# EAGLE design jn5189_pcb_v1 (EAGLE 9.6.2)
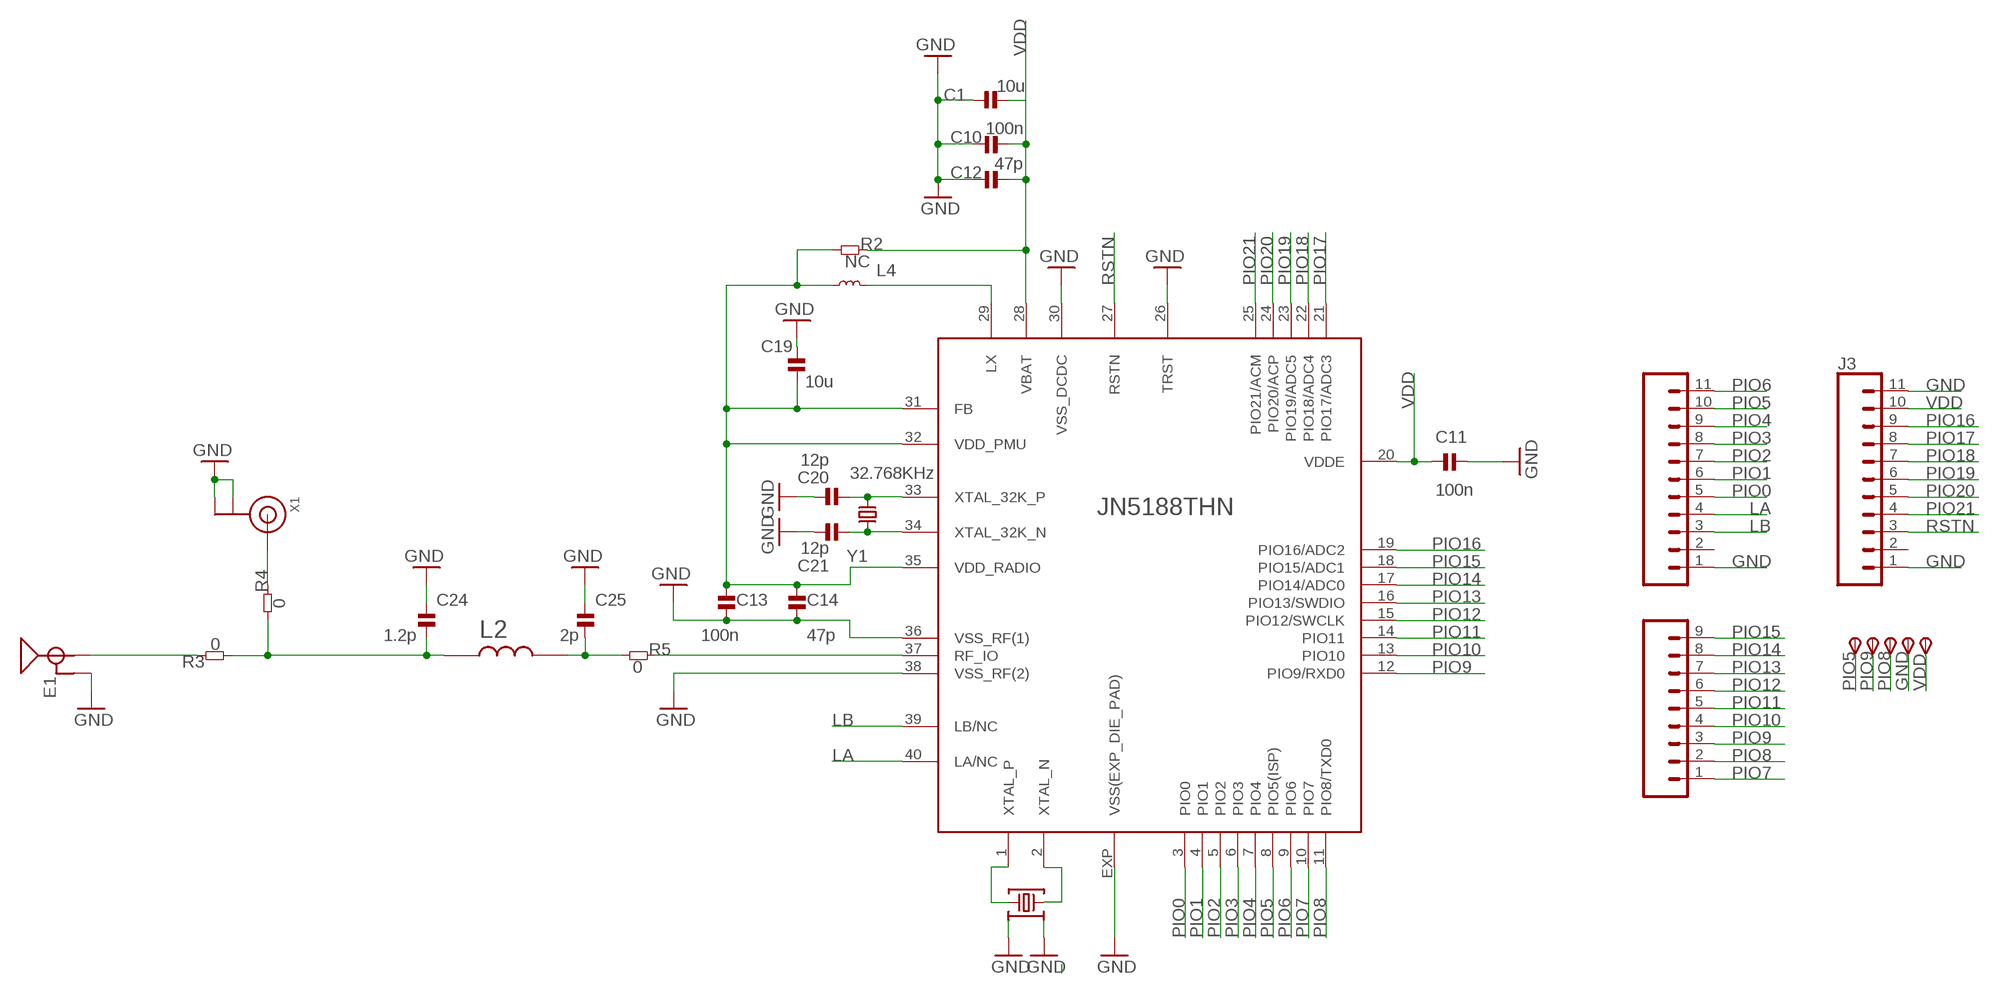
[diagram p0: schematic, sheet 1]

## Parts
3V3  TPSTP11R  [TP11R]
C1  10u  CAP-0805  [_PKG_C_0805]
C10  100n  CAP-0402  [_PKG_C_0402]
C11  100n  CAP-0402  [_PKG_C_0402]
C12  47p  CAP-0402  [_PKG_C_0402]
C13  100n  CAP-0402  [_PKG_C_0402]
C14  47p  CAP-0402  [_PKG_C_0402]
C19  10u  CAP-0805  [_PKG_C_0805]
C20  12p  CAP-0402  [_PKG_C_0402]
C21  12p  CAP-0402  [_PKG_C_0402]
C24  1.2p  CAP-0402  [_PKG_C_0402]
C25  2p  CAP-0402  [_PKG_C_0402]
E1  ANTENNA-GROUNDEDTRACE-15.2MM  [TRACE_ANTENNA_2.4GHZ_15.2MM]
GND  TPSTP11R  [TP11R]
ISP  TPSTP11R  [TP11R]
J1  CONN_11_1.27MM  [1X11-1.27MM]
J2  CONN_051.27MM  [1X05_1.27MM]
J3  CONN_11_1.27MM  [1X11-1.27MM]
L2  3.3n  IND0402IND0402  [INDC1005X40N]
L4  4.7uH  INDUCTOR-0805  [_PKG_C_0805]
R2  NC  RES-0402  [_PKG_C_0402]
R3  0  RES-0402  [_PKG_C_0402]
R4  0  RES-0402  [_PKG_C_0402]
R5  0  RES-0402  [_PKG_C_0402]
RXD  TPSTP11R  [TP11R]
TXD  TPSTP11R  [TP11R]
U$1  JN5188THN  [JN5188THN]
X1  ANTENNA_U.FL  [U.FL]
Y1  32.768KHz  32.768KHZ_Q13FC1350000400  [XTAL-2P-3215]
Y2  32Mhz  48.000MHZ_CX2016DB48000C0FPLC1  [XTAL-4P-2016]

## Nets
GND: C1.1 C10.2 C11.1 C12.2 C13.1 C14.1 C19.1 C20.1 C21.1 C24.2 C25.2 E1.GND GND.TP(PP) J1.1 J3.1 J3.11 U$1.26(TRST) U$1.30(VSS_DCDC) U$1.36(VSS_RF(1)) U$1.38(VSS_RF(2)) U$1.EXP(VSS(EXP_DIE_PAD)) X1.1(GND) X1.2(GND) Y2.2 Y2.4
LA: J1.4 U$1.40(LA/NC)
LB: J1.3 U$1.39(LB/NC)
N$1: L4.2 U$1.29(LX)
N$5: U$1.1(XTAL_P) Y2.1
N$7: U$1.2(XTAL_N) Y2.3
N$9: C13.2 C14.2 C19.2 L4.1 R2.2 U$1.31(FB) U$1.32(VDD_PMU) U$1.35(VDD_RADIO)
N$10: R5.1 U$1.37(RF_IO)
N$11: C25.1 L2.2 R5.2
N$12: C24.1 L2.1 R3.2 R4.2
N$13: R4.1 X1.3(SIGNAL)
N$14: E1.ANT(SIGNAL) R3.1
PIO0: J1.5 U$1.3(PIO0)
PIO1: J1.6 U$1.4(PIO1)
PIO2: J1.7 U$1.5(PIO2)
PIO3: J1.8 U$1.6(PIO3)
PIO4: J1.9 U$1.7(PIO4)
PIO5: ISP.TP(PP) J1.10 U$1.8(PIO5(ISP))
PIO6: J1.11 U$1.9(PIO6)
PIO7: J2.1 U$1.10(PIO7)
PIO8: J2.2 TXD.TP(PP) U$1.11(PIO8/TXD0)
PIO9: J2.3 RXD.TP(PP) U$1.12(PIO9/RXD0)
PIO10: J2.4 U$1.13(PIO10)
PIO11: J2.5 U$1.14(PIO11)
PIO12: J2.6 U$1.15(PIO12/SWCLK)
PIO13: J2.7 U$1.16(PIO13/SWDIO)
PIO14: J2.8 U$1.17(PIO14/ADC0)
PIO15: J2.9 U$1.18(PIO15/ADC1)
PIO16: J3.9 U$1.19(PIO16/ADC2)
PIO17: J3.8 U$1.21(PIO17/ADC3)
PIO18: J3.7 U$1.22(PIO18/ADC4)
PIO19: J3.6 U$1.23(PIO19/ADC5)
PIO20: J3.5 U$1.24(PIO20/ACP)
PIO21: J3.4 U$1.25(PIO21/ACM)
RSTN: J3.3 U$1.27(RSTN)
VDD: 3V3.TP(PP) C1.2 C10.1 C11.2 C12.1 J3.10 R2.1 U$1.20(VDDE) U$1.28(VBAT)
X32K_Q1: C20.2 U$1.33(XTAL_32K_P) Y1.1
X32K_Q2: C21.2 U$1.34(XTAL_32K_N) Y1.2
Unconnected: J1.2 J3.2

## Library data of the parts
3V3 GND ISP RXD TXD = testpad:TPS: TEST PIN
C1 C10-C14 C19-C21 C24 C25 = ok-discretes-dev:CAP
E1 = SparkFun-RF:ANTENNA-GROUNDED: Antenna w/ Ground Connection 2.4GHz antennae with signal and ground terminals. TRACE_ANTENNA_2.4GHZ_15.2MM - Meander Trace antenna 15.2 x 5.7mm footprint Based on layout from TI app note AN043 <http://www.ti.com/lit/an/swra117d/swra117d.pdf>. TRACE_ANTENNA_2.4GHZ_25.7MM - Inverted F trace antenna 25.7 x 7.5 mm footprint. Based on layout from TI design note DN0007 <http://www.ti.com/lit/an/swru120b/swru120b.pdf>.
J1 J3 = SparkFun-Connectors:CONN_11: Multi connection point. Often used as Generic Header-pin footprint for 0.1 inch spaced/style header connections On any of the 0.1 inch spaced packages, you can populate with these: Break Away Headers - Straight <https://www.sparkfun.com/products/116> (PRT-00116) Break Away Male Headers - Right Angle <https://www.sparkfun.com/products/553> (PRT-00553) Female Headers <https://www.sparkfun.com/products/115> (PRT-00115) Break Away Headers - Machine Pin <https://www.sparkfun.com/products/117> (PRT-00117) Break Away Female Headers - Swiss Machine Pin <https://www.sparkfun.com/products/743> (PRT-00743) For SCREWTERMINALS and SPRING TERMINALS visit here: Screw Terimnals on SparkFun.com <https://www.sparkfun.com/search/results?term=Screw+Terminals> (5mm/3.5mm/2.54mm spacing) This device is also useful as a general connection point to wire up your design to another part of your project. Our various solder wires solder well into these plated through hole pads. Hook-Up Wire - Assortment (Stranded, 22 AWG) <https://www.sparkfun.com/products/11375> (PRT-11375) Hook-Up Wire - Assortment (Solid Core, 22 AWG) <https://www.sparkfun.com/products/11367> (PRT-11367) View the entire wire category on our website here <https://www.sparkfun.com/categories/141>
J2 = SparkFun-Connectors:CONN_05: Multi connection point. Often used as Generic Header-pin footprint for 0.1 inch spaced/style header connections On any of the 0.1 inch spaced packages, you can populate with these: Break Away Headers - Straight <https://www.sparkfun.com/products/116> (PRT-00116) Break Away Male Headers - Right Angle <https://www.sparkfun.com/products/553> (PRT-00553) Female Headers <https://www.sparkfun.com/products/115> (PRT-00115) Break Away Headers - Machine Pin <https://www.sparkfun.com/products/117> (PRT-00117) Break Away Female Headers - Swiss Machine Pin <https://www.sparkfun.com/products/743> (PRT-00743) For SCREWTERMINALS and SPRING TERMINALS visit here: Screw Terimnals on SparkFun.com <https://www.sparkfun.com/search/results?term=Screw+Terminals> (5mm/3.5mm/2.54mm spacing) This device is also useful as a general connection point to wire up your design to another part of your project. Our various solder wires solder well into these plated through hole pads. Hook-Up Wire - Assortment (Stranded, 22 AWG) <https://www.sparkfun.com/products/11375> (PRT-11375) Hook-Up Wire - Assortment (Solid Core, 22 AWG) <https://www.sparkfun.com/products/11367> (PRT-11367) View the entire wire category on our website here <https://www.sparkfun.com/categories/141> Special notes: Molex polarized connector foot print use with SKU : PRT-08231 with associated crimp pins and housings. 1MM SMD Version SKU: PRT-10208
L2 = discretes-dev:IND0402: RESISTOR, 0402 0.063W 1% 3M6; Resistance:3.6Mohm; Resistance Tolerance:± 1%; Power Rating:0.063W; Voltage Rating:50V; Series:RC32H; Temperature Coefficient:± 100ppm/°C; Resistor Element Type:Thick Film; Resistor Case Style:0402; No. of Pins:2; SVHC:No SVHC; Case Style:0402; External Length / Height:1mm; Temperature Coeff. +:100ppm/°C; Temperature Coeff. -:100ppm/°C; External Depth:0.35mm; External Width:0.5mm; Operating Temperature Range:-55°C to +155°C; Overload Voltage:100V Check prices <https://pricing.snapeda.com/parts/RC0402FR-073M6L/Yageo/view-part?ref=eda>; AVAILABILITY: Good; DESCRIPTION: RESISTOR, 0402 0.063W 1% 3M6; Resistance:3.6Mohm; Resistance Tolerance:± 1%; Power Rating:0.063W; Voltage Rating:50V; Series:RC32H; Temperature Coefficient:± 100ppm/°C; Resistor Element Type:Thick Film; Resistor Case Style:0402; No. of Pins:2; SVHC:No SVHC; Case Style:0402; External Length / Height:1mm; Temperature Coeff. +:100ppm/°C; Temperature Coeff. -:100ppm/°C; External Depth:0.35mm; External Width:0.5mm; Operating Temperature Range:-55°C to +155°C; Overload Voltage:100V; MF: Yageo; MP: RC0402FR-073M6L; PACKAGE: 1005 Panasonic Electronic Components; PRICE: None; PURCHASE-URL: https://pricing.snapeda.com/search/part/RC0402FR-073M6L/?ref=eda
L4 = ok-discretes-dev:INDUCTOR
R2-R5 = ok-discretes-dev:RES
U$1 = JN5189_ HVQFN40:JN5188THN: JN5168 - ZigBee, RF4CE, JenNet-IP and IEEE802.15.4 wireless microcontroller with 256 kB Flash, 32 kB RAM Check availability <https://pricing.snapeda.com/parts/JN5168/A02Z/NXP%20Semiconductors/view-part?ref=eda>; AVAILABILITY: Not in stock; DESCRIPTION: JN5168 - ZigBee, RF4CE, JenNet-IP and IEEE802.15.4 wireless microcontroller with 256 kB Flash, 32 kB RAM; MF: NXP Semiconductors; MP: JN5168/A02Z; PACKAGE: None; PRICE: None
X1 = adafruit:ANTENNA_U.FL: U.FL Antenna Connector
Y1 = ok-xtal-osc-dev:32.768KHZ_Q13FC1350000400: SMD Crystal Resonators 32.768KHz +/-20ppm SMD-3215_2P RoHS Datasheet <https://datasheet.lcsc.com/szlcsc/1901081604_Seiko-Epson-Q13FC1350000400_C32346.pdf>; LCSC_PART: C32346; MFG_NAME: SEIKO EPSON; MFG_PART: Q13FC1350000400
Y2 = ok-xtal-osc-dev:48.000MHZ_CX2016DB48000C0FPLC1: 48MHz ±10ppm Crystal 7pF 50 Ohms 4-SMD, No Lead Datasheet <https://media.digikey.com/pdf/Data%20Sheets/Kyocera%20International/CX2016DB48000C0FPLC1_DS.pdf>; DIGIKEY_PART: 1253-2042-1-ND; MFG_NAME: KYOCERA; MFG_PART: CX2016DB48000C0FPLC1

## Board
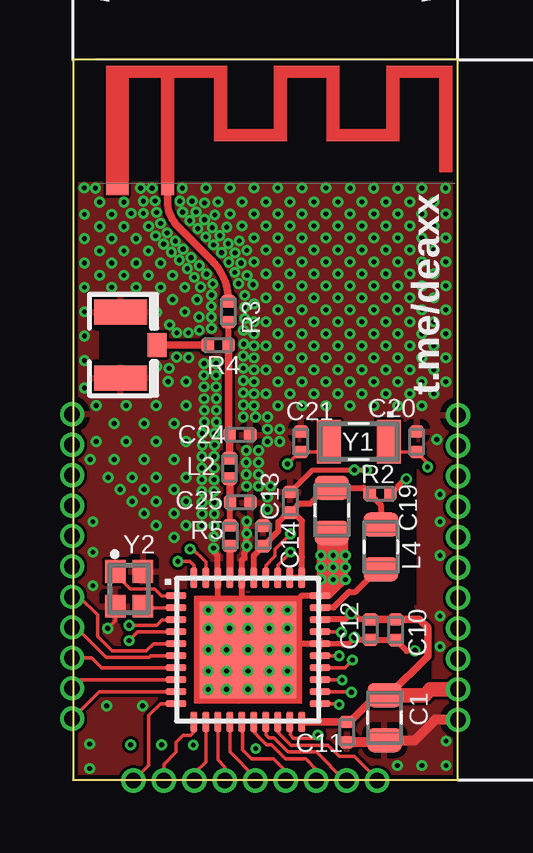
[diagram p1: board, top side]
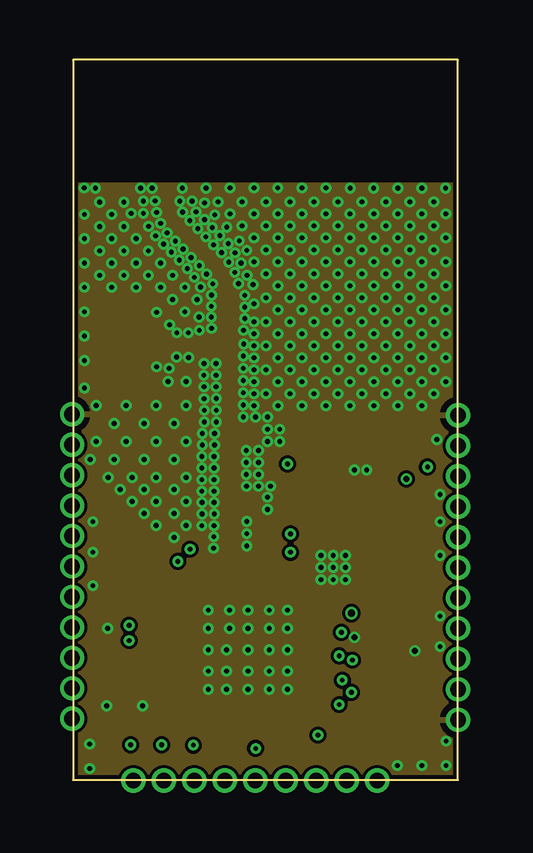
[diagram p2: board, inner layer Route2]
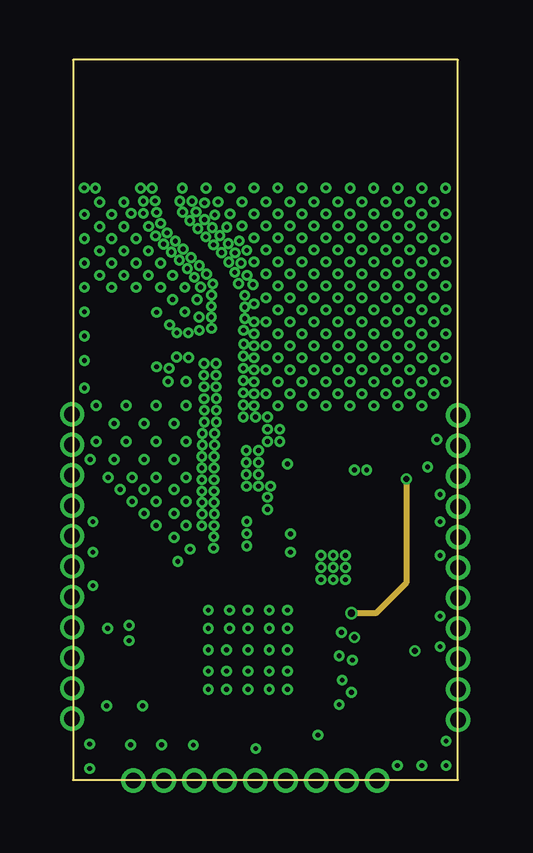
[diagram p3: board, inner layer Route15]
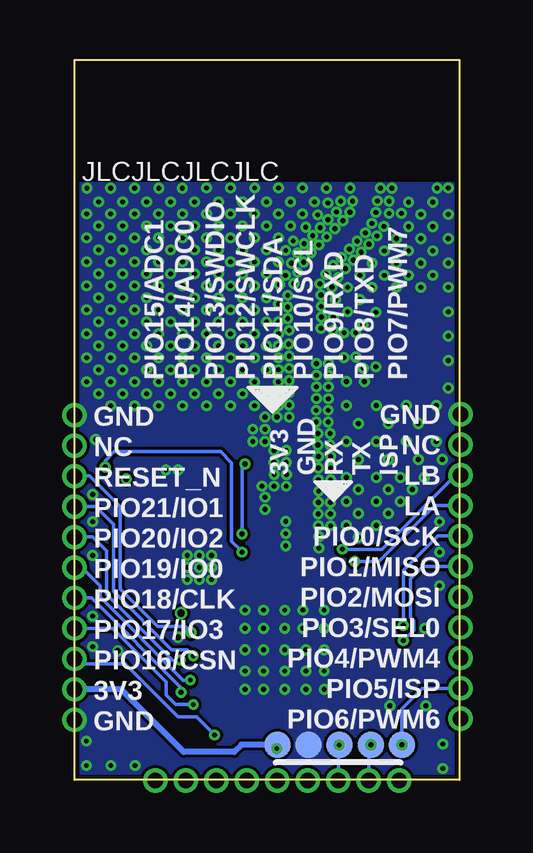
[diagram p4: board, bottom side, seen from below]

Size 16.05 x 30.01 mm. Coordinates in mm from the lower left corner, seen from the top.
Outline: 16.05,0 16.05,30.01 0,30.01 0,0 16.05,0
Copper layers (1*2*15*16): Top 0.035559375mm / dielectric 0.17018125mm / Route2 0.01778125mm / dielectric 0.4mm / Route15 0.01778125mm / dielectric 0.17018125mm / Bottom 0.035559375mm
Design rules "oshpark-4layer *": minimum track width 6mil, minimum drill 0.2mm, track to track 5mil, track to pad 5mil, pad to pad 5mil, via to via 5mil, smd to smd 5mil, copper to edge 0.16mm, drill to drill 0.2mm, minimum pad ring 4mil, minimum via ring 4mil, stop-mask expansion 2.5mil, vias tented up to drill 50mil, thermal gap 10mil
tRestrict: area 11.4,3.9 to 14.9,7.2

### Footprints (pad centres in the part's own frame; a part is rotated, then mirrored left to right if it is on the bottom)
TP11R = smd 1.1 x 1.1: TP 0,0
_PKG_C_0805 = smd 1 x 1.42: 1 -0.935,0; 2 0.935,0
_PKG_C_0402 = smd 0.54 x 0.6: 1 -0.43,0; 2 0.43,0
TRACE_ANTENNA_2.4GHZ_15.2MM = smd 0.5 x 0.5: ANT 0,-0.25 | smd 0.9 x 0.5: GND -2.1,-0.25
1X11-1.27MM = drill 0.65 pad 1.016: 1 0,0; 2 1.27,0; 3 2.54,0; 4 3.81,0; 5 5.08,0; 6 6.35,0; 7 7.62,0; 8 8.89,0; 9 10.16,0; 10 11.43,0; 11 12.7,0
1X05_1.27MM = drill 0.65 pad 1.016: 1 0,0; 2 1.27,0; 3 2.54,0; 4 3.81,0; 5 5.08,0; 6 6.35,0; 7 7.62,0; 8 8.89,0; 9 10.16,0
INDC1005X40N = smd 0.54 x 0.6: 1 -0.432,0; 2 0.432,0
JN5188THN = smd 0.85 x 0.3: 1 -3,2.25; 2 -3,1.75; 3 -3,1.25; 4 -3,0.75; 5 -3,0.25; 6 -3,-0.25; 7 -3,-0.75; 8 -3,-1.25; 9 -3,-1.75; 10 -3,-2.25; 21 3,-2.25; 22 3,-1.75; 23 3,-1.25; 24 3,-0.75; 25 3,-0.25; 26 3,0.25; 27 3,0.75; 28 3,1.25; 29 3,1.75; 30 3,2.25 | smd 0.3 x 0.85: 11 -2.25,-3; 12 -1.75,-3; 13 -1.25,-3; 14 -0.75,-3; 15 -0.25,-3; 16 0.25,-3; 17 0.75,-3; 18 1.25,-3; 19 1.75,-3; 20 2.25,-3; 31 2.25,3; 32 1.75,3; 33 1.25,3; 34 0.75,3; 35 0.25,3; 36 -0.25,3; 37 -0.75,3; 38 -1.25,3; 39 -1.75,3; 40 -2.25,3 | smd 4 x 4: EXP 0.001,-0.013
U.FL = smd 2.2 x 1.05: 1 0,1.375; 2 0,-1.375 | smd 0.8 x 1: 3 1.525,0
XTAL-2P-3215 = smd 1 x 1.8: 1 -1.25,0; 2 1.25,0
XTAL-4P-2016 = smd 0.95 x 0.85: 1 -0.725,-0.575; 2 0.725,-0.575; 3 0.725,0.575; 4 -0.725,0.575

### Placement (x,y rotation side)
3V3  7.6,1.46 0 bottom
C1  12.99,2.59 90 top
C10  13.46,6.26 270 top
C11  11.41,1.99 90 top
C12  12.4,6.26 270 top
C13  9.06,11.57 270 top
C14  7.93,10.17 270 top
C19  10.79,11.24 90 top
C20  14.33,14.1 270 top
C21  9.5,14.1 270 top
C24  6.96,14.38 0 top
C25  6.97,11.57 0 top
E1  3.94,24.87 0 top
GND  6.3,1.46 0 bottom
ISP  2.4,1.46 0 bottom
J1  -0.04,15.25 270 top
J2  2.52,-0.03 0 top
J3  16.05,15.2 270 top
L2  6.53,12.98 270 top
L4  12.84,9.71 270 top
R2  12.8,11.93 180 top
R3  6.48,19.51 270 top
R4  6.05,18.12 0 top
R5  6.55,10.18 90 top
RXD  5,1.46 0 bottom
TXD  3.7,1.46 0 bottom
U$1  7.29,5.42 0 top
X1  1.99,18.13 0 top
Y1  11.91,14.1 180 top
Y2  2.34,7.96 270 top

### Tracks (layer width: path | path; a pad name or v marks a point on that pad's centre or on a via)
GND  (via drill 0.2 pad 0.45, 0.25)
  Top 0.152: Y2.2 1.76,6.63 v1.45,6.31 | C12.2 12.38,5.8
  Top 0.2: C13.1 9.98,12.92 v11.73,12.92 v12.24,12.92 | v11.73,5.93 11.48,5.67 U$1.26
  Top 0.254: v6.53,7.07 6.04,7.56 U$1.38 6.02,8.44 6.02,9.36 5.86,9.52 v5.86,9.66 | v7.29,7.07 7.04,7.32 U$1.36 7.04,9.15 7.16,9.27 7.16,9.51 7.24,9.59 v7.24,9.76 v7.24,10.26 v7.24,10.77 | U$1.30 9.55,7.68 v8.94,7.07 | U$1.30 10.29,8.6 | 10.29,8.6 10.29,8.98 | 10.29,8.98 10.29,9.23 | 10.29,9.23 10.29,9.49 | 10.29,9.49 10.29,10.06 10.34,10.11 10.34,9.79 | v11.35,8.34 11.35,8.47 | 11.35,8.47 v11.35,8.85 | v11.35,8.85 11.35,9.11 | 11.35,9.11 v11.35,9.36 | v11.35,9.36 11.35,9.61 | 11.35,9.61 11.35,9.74 | 11.35,9.74 11.35,10.5 11,10.5 C19.1 | v10.34,8.34 10.97,8.34 | 10.97,8.34 v11.35,8.34 | 10.46,7.71 10.33,7.71 U$1.30 | v10.34,8.34 10.46,8.47 11.35,8.47 | v11.35,8.85 11.1,8.6 10.29,8.6 | v11.35,8.85 v10.34,8.85 10.59,9.11 11.35,9.11 | v11.35,8.85 10.42,8.85 10.29,8.98 | v11.35,9.36 11.23,9.23 10.29,9.23 | v10.34,9.36 v11.35,9.36 | v11.35,9.36 10.42,9.36 10.29,9.49 | v10.34,9.36 10.59,9.61 11.1,9.61 | 11.23,9.61 11.35,9.61 | 11.35,9.74 11.29,9.68 | 11.29,9.68 11.23,9.61 | 11.23,9.61 11.1,9.61 | C19.1 10.79,10.24 10.44,9.89 | C19.1 10.79,9.92 | 10.79,9.92 10.85,9.87 | 10.85,9.87 11.1,9.61 | v10.34,9.36 10.34,9.79 | 10.34,9.79 10.44,9.89 | 10.44,9.89 10.44,9.76 v10.85,9.36 | v10.85,9.36 10.85,9.87 | v10.85,9.36 10.79,9.41 10.79,9.82 | C19.1 10.79,10.17 11.29,9.68 | v11.35,9.36 v10.85,9.36 | v10.34,9.36 10.79,9.82 | 10.79,9.82 10.79,9.92 | v10.34,8.34 10.34,7.84 10.46,7.71 | v10.85,8.34 10.85,7.84 | 10.85,7.84 10.66,7.65 10.59,7.65 10.59,7.71 | v10.34,8.34 10.59,8.09 10.59,7.71 | 10.46,7.71 10.97,8.22 10.97,8.34 | U$1.30 10.96,8.34 v11.35,8.34 | v11.35,8.34 10.85,7.84 | 10.46,7.71 10.59,7.71 | U$1.26 8.84,5.67 8.57,5.94 8.18,5.55 v8.18,5.42 | v14.25,5.37 13.91,5.37 C10.2 C12.2 11.84,5.83 v11.73,5.93
  Top 0.406: J3.11 15.11,2.5 14.26,1.65 C1.1 12.9,1.56 C11.1
  other vias: 5.64,7.07 6.53,6.31 5.64,6.31 5.64,5.42 5.64,4.53 8.18,7.07 6.4,5.42 7.29,6.31 8.18,6.31 8.94,6.31 7.29,5.42 7.29,4.53 7.29,3.77 8.18,3.77 8.94,3.77 8.94,4.53 8.94,5.42 6.4,4.53 6.4,3.77 5.64,3.77 8.18,4.53 10.85,8.85 8.11,11.27 8.11,11.78 8.24,12.24 7.23,12.24 7.22,12.73 7.22,13.23 7.22,13.72 7.73,13.72 7.73,13.23 7.73,12.73 7.74,12.24 8.11,14.11 8.11,14.61 8.11,15.12 7.61,15.12 7.1,15.12 7.1,15.63 7.1,16.14 7.1,16.65 7.1,17.15 7.1,17.66 7.12,18.17 7.1,18.74 7.16,19.23 7.16,19.71 7.16,20.2 6.9,20.69 6.75,21.16 6.5,21.59 6.2,21.97 5.86,22.31 5.53,22.63 5.2,22.98 4.87,23.31 4.57,23.67 4.45,24.12 4.56,24.67 3.3,24.67 3.42,24.13 3.49,23.65 3.65,23.2 3.93,22.8 4.27,22.46 4.59,22.13 4.92,21.77 5.27,21.44 5.57,21.08 5.82,20.68 5.77,20.21 5.77,19.74 5.76,19.29 5.77,18.82 4.03,18.97 4.33,18.64 4.81,18.63 5.27,18.74 5.55,24.67 6.55,24.68 7.55,24.68 8.54,24.68 9.55,24.68 10.55,24.68 11.56,24.67 12.54,24.67 13.55,24.67 14.55,24.67 15.54,24.67 4.96,24.12 5.13,23.68 5.49,23.35 5.81,23.02 6.12,22.69 6.47,22.36 6.76,21.97 7,21.54 7.26,21.03 7.51,20.65 2.93,24.12 2.93,23.61 3.15,23.07 3.45,22.68 3.78,22.34 4.1,22 4.43,21.67 4.76,21.32 5.06,20.95 5.32,20.55 6.05,24.09 7.05,24.09 8.05,24.09 9.05,24.09 10.05,24.09 11.05,24.09 12.05,24.09 13.05,24.09 14.05,24.09 15.05,24.09 6.55,23.59 7.55,23.59 8.55,23.59 9.55,23.59 10.55,23.59 11.55,23.59 12.55,23.59 13.55,23.59 14.55,23.59 15.55,23.59 7.05,23.09 8.05,23.09 9.05,23.09 10.05,23.09 11.05,23.09 12.05,23.09 13.05,23.09 7.55,22.59 8.55,22.59 9.55,22.59 10.55,22.59 11.55,22.59 12.55,22.59 8.05,22.09 9.05,22.09 10.05,22.09 11.05,22.09 12.05,22.09 13.05,22.09 13.55,22.59 14.05,23.09 15.05,23.09 8.55,21.59 7.55,21.59 9.55,21.59 8.05,21.09 9.05,21.09 10.05,21.09 11.05,21.09 12.05,21.09 10.55,21.59 11.55,21.59 12.55,21.59 13.05,21.09 14.55,22.59 15.55,22.59 14.05,22.09 15.05,22.09 13.55,21.59 14.55,21.59 15.55,21.59 14.05,21.09 15.05,21.09 8.55,20.59 9.55,20.59 10.55,20.59 11.55,20.59 12.55,20.59 13.55,20.59 14.55,20.59 15.55,20.59 8.05,20.09 9.05,20.09 10.05,20.09 11.05,20.09 12.05,20.09 13.05,20.09 14.05,20.09 15.05,20.09 8.55,19.59 8.05,19.09 9.05,19.09 9.55,19.59 10.05,19.09 10.55,19.59 8.05,18.09 8.55,18.59 9.05,18.09 9.55,18.59 11.55,19.59 12.55,19.59 13.55,19.59 14.55,19.59 15.55,19.59 11.05,19.09 12.05,19.09 13.05,19.09 14.05,19.09 15.05,19.09 10.55,18.59 11.55,18.59 12.55,18.59 13.55,18.59 14.55,18.59 15.55,18.59 10.05,18.09 11.05,18.09 12.05,18.09 13.05,18.09 14.05,18.09 15.05,18.09 8.55,17.59 9.55,17.59 10.55,17.59 11.55,17.59 12.55,17.59 13.55,17.59 14.55,17.59 15.55,17.59 8.05,17.09 9.05,17.09 10.05,17.09 11.05,17.09 12.05,17.09 13.05,17.09 14.05,17.09 15.05,17.09 8.55,16.59 9.55,16.59 10.55,16.59 11.55,16.59 12.55,16.59 13.55,16.59 14.55,16.59 15.55,16.59 9.05,16.09 10.05,16.09 11.05,16.09 12.05,16.09 13.05,16.09 14.05,16.09 15.05,16.09 9.55,15.59 10.55,15.59 11.55,15.59 12.55,15.59 13.55,15.59 14.55,15.59 8.05,16.09 8.55,15.59 7.55,18.59 7.55,18.09 7.55,17.59 7.55,17.09 7.55,16.59 7.55,16.09 7.55,15.59 7.55,19.09 7.55,19.84 0.46,24.68 0.47,23.58 0.47,22.56 0.47,21.54 0.47,20.53 0.47,19.51 0.47,18.5 0.47,17.48 0.47,16.34 1.1,24.08 1.1,23.07 1.1,22.05 1.1,21.04 1.61,23.58 1.61,22.56 1.61,21.54 1.61,20.53 2.12,24.08 2.12,23.07 2.12,22.05 2.12,21.04 2.63,22.56 2.63,21.54 2.63,20.53 3.14,21.04 3.14,22.05 3.64,21.54 3.64,20.53 4.15,21.04 4.66,20.53 3.49,19.49 4.66,19.51 4.15,20.02 5.17,20.02 5.25,19.29 5.91,23.56 6.41,23.05 5.48,24.05 6.94,22.47 7.25,22.07 2.42,23.61 5.88,10.59 5.89,11.08 5.88,11.57 5.87,12.03 5.88,12.51 5.88,13 5.88,13.48 5.9,13.96 5.9,14.44 5.97,14.92 5.97,15.41 5.97,15.89 5.97,16.39 5.96,16.87 5.97,17.36 5.87,10.13 8.62,14.61 8.62,14.11 5.46,17.36 5.45,16.87 5.46,16.39 5.47,15.89 5.48,15.41 5.47,14.92 5.39,14.44 5.39,13.96 5.37,13.48 5.37,13 5.37,12.51 5.37,12.03 5.38,11.57 5.38,11.08 5.37,10.59 0.96,15.61 2.21,15.61 3.46,15.61 4.71,15.61 1.71,14.86 2.96,14.86 4.21,14.86 0.96,14.11 2.21,14.11 3.46,14.11 4.71,14.11 1.71,13.36 2.96,13.36 4.21,13.36 4.71,12.61 2.46,12.61 3.46,12.61 4.21,12.11 2.96,12.11 1.46,12.61 0.71,13.36 1.96,12.11 2.46,11.61 3.46,11.61 4.71,11.61 2.96,11.11 4.21,11.11 4.71,10.61 3.46,10.61 4.21,10.11 4.71,16.61 3.96,16.61 3.49,17.22 4.01,17.15 4.31,17.62 4.82,17.61 15.18,14.19 15.3,11.9 15.3,10.76 15.3,9.36 15.3,6.82 15.3,5.55 15.56,1.61 15.56,0.6 14.54,0.6 13.53,0.6 0.7,0.47 0.7,1.49 0.83,8.09 0.83,9.49 0.83,10.76 2.9,3.09 1.4,3.09 0.93,24.67 2.82,24.67
  pour Route2: -0.03,24.84 -0.03,-0.19 16.13,-0.19 16.13,24.84
  pour Bottom (no thermals): -0.03,-0.19 16.25,-0.19 16.25,24.86 -0.03,24.86
  pour Top: 14.4,14.69 14.4,7.2 9.45,7.2 9.45,14.82 16.28,14.82 16.28,24.85 -0.08,24.85 -0.08,-0.17 16.43,-0.17 16.43,14.69
LA  (via drill 0.2 pad 0.45)
  Top 0.152: U$1.40 5.04,8.94 4.88,9.11 v4.37,9.11
  Bottom 0.152: v4.37,9.11 3.35,9.11 1.02,11.43 0.3,11.43 J1.4
LB  (via drill 0.2 pad 0.45)
  Top 0.152: U$1.39 5.54,9.08 4.94,9.68 v4.88,9.61
  Bottom 0.152: v4.88,9.61 3.24,9.61 0.15,12.7 J1.3
N$1
  Top 0.254: U$1.29 10.3,7.17 10.31,7.19 10.86,7.19 11.51,7.84 11.77,7.84 12.71,8.78 L4.2
N$5
  Top 0.152: Y2.1 1.76,8.58 2.37,7.97 3.41,7.97 3.7,7.67 U$1.1
N$7
  Top 0.152: U$1.2 2.98,7.17 Y2.3
N$9
  Top 0.254: U$1.32 U$1.31 9.54,9.28 9.55,9.29 9.55,10.79 9.13,11.2 | U$1.35 7.54,9.35 C14.2 8.56,10.37 8.56,10.75 8.95,11.14 C13.2 9.13,11.2 | 9.13,11.2 9.44,11.52 9.89,11.52 10.54,12.17 C19.2 12.13,12.17 R2.2 12.84,11.46 L4.1 12.77,10.71 12.77,10.77
N$10
  Top 0.254: 6.54,9.74 R5.1
  Top 0.305: U$1.37 6.54,9.74
N$11
  Top 0.254: L2.2 arc45 L2.2 | C25.1 R5.2
  Top 0.305: C25.1 L2.2
N$12
  Top 0.254: R4.2 R3.2 | 6.52,14.36 arc-45 C24.1 | 6.5,14.45 arc45 C24.1 | C24.1 6.48,14.43 | L2.1 6.52,13.43
  Top 0.305: 6.48,14.43 R4.2 | 6.52,13.43 6.52,14.36
N$13
  Top 0.254: R4.1 | X1.3
  Top 0.305: X1.3 R4.1
N$14
  Top 0.254: R3.1 6.48,19.96
  Top 0.305: 6.48,19.96 arc45 5.77,21.68 4.37,23.08 arc-45 3.94,24.11 E1.ANT
PIO0  (via drill 0.2 pad 0.45)
  Top 0.152: U$1.3 3.71,6.67 3.48,6.44 v2.34,6.44
  Bottom 0.152: v2.34,6.44 2.34,8.72 0.9,10.16 0.43,10.16 0.27,10.16 J1.5
PIO1  (via drill 0.2 pad 0.45)
  Top 0.152: U$1.4 4.28,6.16 2.69,6.16 v2.34,5.8
  Bottom 0.152: v2.34,5.8 1.91,6.23 1.91,6.62 2.06,6.76 2.06,8.37 1.53,8.89 0.27,8.89 | 0.27,8.89 0.27,8.85 | J1.6 0.27,8.89
PIO2
  Top 0.152: U$1.5 3.35,5.67 3.05,5.38 1.62,5.38 1.02,5.98 1.02,6.87 0.26,7.62 J1.7
PIO3
  Top 0.152: U$1.6 3.24,5.17 3.17,5.1 1.38,5.1 0.12,6.35 J1.8
PIO4
  Top 0.152: U$1.7 1.18,4.67 0.77,5.08 0.43,5.08 0.27,5.08 J1.9
PIO5  (via drill 0.2 pad 0.45)
  Top 0.152: U$1.8 0.32,4.17 J1.10
  Bottom 0.152: ISP.TP 2.4,2.96 1.54,3.81 0.4,3.81 0.27,3.81 J1.10
  other vias: 2.4,1.46
PIO6
  Top 0.152: J1.11 1.09,3.67 U$1.9
PIO7
  Top 0.152: J2.1 3.15,0.61 3.15,2.68 3.64,3.17 U$1.10
PIO8  (via drill 0.2 pad 0.45)
  Top 0.152: J2.2 3.79,0.65 4.3,1.16 4.3,1.56 4.6,1.86 4.9,1.86 5.04,2 U$1.11
  Bottom 0.152: TXD.TP 3.79,1.37 J2.2
  other vias: 3.7,1.46
PIO9  (via drill 0.2 pad 0.45)
  Top 0.152: U$1.12 5.54,0.75 5.06,0.27 J2.3
  Bottom 0.152: v5.01,1.44 5.06,1.4 J2.3
  Bottom 0.254: RXD.TP | RXD.TP 5.06,1.4
PIO10
  Top 0.152: U$1.13 6.04,0.83 6.33,0.54 J2.4
PIO11
  Top 0.152: U$1.14 6.54,1.16 7.6,0.11 J2.5
PIO12
  Top 0.152: U$1.15 7.06,2.4 7.06,1.26 7.45,0.87 8.37,0.87 8.84,0.39 8.84,0.02 8.84,0 J2.6
PIO13
  Top 0.152: U$1.16 7.54,1.99 7.76,1.77 8.06,1.47 8.27,1.47 8.86,0.88 9.28,0.88 9.7,0.88 10.14,0.45 J2.7
PIO14
  Top 0.152: 8.05,2.41 U$1.17 8.04,1.88 8.18,1.75 8.38,1.75 8.97,1.16 10.14,1.16 11.33,-0.03 J2.8
PIO15
  Top 0.152: U$1.18 8.54,1.99 9.09,1.44 10.64,1.44 11.1,0.98 11.73,0.98 12.68,0.04 J2.9
PIO16  (via drill 0.2 pad 0.45)
  Top 0.152: U$1.19 9.07,2.39 9.07,1.87 9.19,1.74 10.08,1.74 v10.21,1.87
  Bottom 0.152: v10.21,1.87 10.97,2.63 11.73,2.63 13.94,4.84 15.85,4.84 J3.9
PIO17  (via drill 0.2 pad 0.45)
  Top 0.152: U$1.21 11.06,3.17 v11.1,3.14
  Bottom 0.152: 11.35,3.14 v11.1,3.14 11.85,3.14 12.24,3.53 12.24,4.08 14.47,6.31 J3.8
PIO18  (via drill 0.2 pad 0.45)
  Top 0.152: U$1.22 11.58,3.67 v11.61,3.64
  Bottom 0.152: v11.61,3.64 11.61,3.84 15.35,7.58 J3.7
PIO19  (via drill 0.2 pad 0.45)
  Top 0.152: U$1.23 11.21,4.17 v11.23,4.15
  Bottom 0.152: v11.23,4.15 11.52,4.15 14.99,7.62 14.99,8.09 15.75,8.85 J3.6
PIO20  (via drill 0.2 pad 0.45)
  Top 0.152: U$1.24 11.34,4.67 v11.65,4.99
  Bottom 0.152: v11.65,4.99 11.96,4.99 14.71,7.73 14.71,9.54 15.29,10.12 J3.5
PIO21  (via drill 0.2 pad 0.45)
  Top 0.152: U$1.25 v11.1,5.17
  Bottom 0.152: v11.1,5.17 11.35,5.42 12,5.42 14.43,7.85 14.43,10.65 15.16,11.39 J3.4
RSTN  (via drill 0.2 pad 0.45)
  Top 0.152: U$1.27 11.17,6.17 v11.19,6.15
  Bottom 0.152: J3.3 15.42,12.66 14.15,11.39 14.15,7.96 12.59,6.4 11.45,6.4 v11.19,6.15
VDD  (via drill 0.2 pad 0.45, 0.25, 0.3)
  Top 0.254: C11.2 | R2.1 13.84,12.53 v13.89,12.53 | U$1.28 10.31,6.69 11.35,6.69 v11.61,6.95 11.69,6.95 11.95,6.69 C12.1
  Top 0.305: C11.2 11.54,2.42 12.64,3.52 C1.2 13.16,3.52 14.79,5.15 14.79,6.35 14.44,6.69 C10.1 C12.1 12.38,6.67 | U$1.20 C11.2
  Top 0.61: C1.2 14.66,3.52 14.91,3.77 J3.10
  Route15 0.254: v13.89,12.53 13.89,8.22 12.62,6.95 v11.61,6.95
  Bottom 0.254: J3.10 14.11,3.77 11.5,1.16 9.4,1.16 9.1,1.46 3V3.TP 7.6,1.32 v7.62,1.3
X32K_Q1  (via drill 0.2 pad 0.45)
  Top 0.152: Y1.1 13.59,13.66 C20.2 14.78,13.21 v14.78,13.04 | U$1.33 8.54,8.96 v9.07,9.49
  Bottom 0.152: v9.07,9.49 9.07,9.52 9.5,9.94 9.5,13.22 9.96,13.68 14.4,13.68 14.78,13.3 v14.78,13.04
X32K_Q2  (via drill 0.2 pad 0.45)
  Top 0.152: Y1.2 10.66,13.75 10.46,13.55 10.35,13.66 C21.2 9.44,13.66 v8.94,13.17 | v9.07,10.25 8.43,9.61 8.43,9.34 8.04,8.95 U$1.34
  Bottom 0.152: v8.94,13.17 9.07,13.04 v9.07,10.25

### Text on the board
tNames: . | t.me/deaxx | .
bNames: JLCJLCJLCJLC | PIO7/PWM7 | PIO8/TXD | PIO9/RXD | PIO10/SCL | PIO11/SDA | PIO12/SWCLK | PIO13/SWDIO | PIO14/ADC0 | PIO15/ADC1 | GND | GND | NC | NC | LB | ISP | TX | RX | GND | 3V3 | LA | RESET_N | PIO0/SCK | PIO21/IO1 | PIO20/IO2 | PIO1/MISO | PIO2/MOSI | PIO19/IO0 | PIO3/SEL0 | PIO18/CLK | PIO4/PWM4 | PIO17/IO3 | PIO16/CSN | PIO5/ISP | PIO6/PWM6 | 3V3 | GND